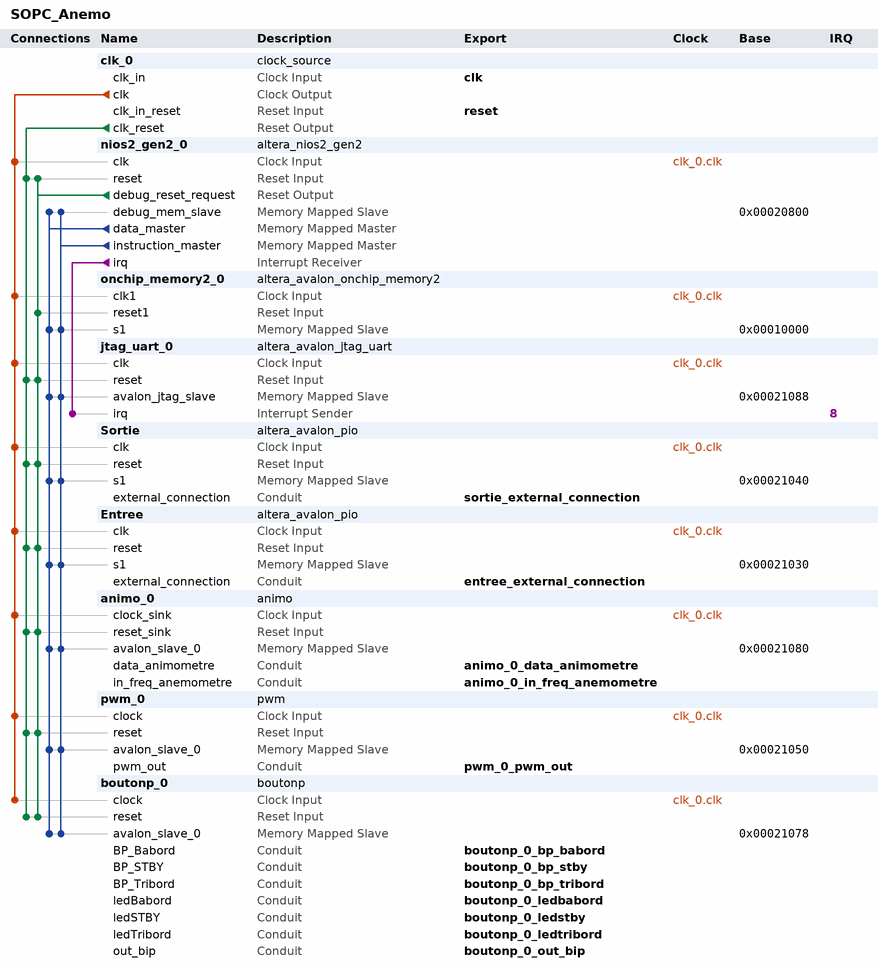
[diagram p0: system contents]
# Platform Designer (Qsys) system SOPC_Anemo, Cyclone IV E EP4CE22F17C6
# Parameters at their usual value, and those the tool derives, are not listed.
package require -exact qsys 18.1
create_system SOPC_Anemo
set_project_property DEVICE_FAMILY {Cyclone IV E}
set_project_property DEVICE EP4CE22F17C6

add_instance clk_0 clock_source 18.1
set_instance_parameter_value clk_0 clockFrequency 50000000

add_instance nios2_gen2_0 altera_nios2_gen2 18.1
set_instance_parameter_value nios2_gen2_0 dcache_size 2048
set_instance_parameter_value nios2_gen2_0 exceptionSlave onchip_memory2_0.s1
set_instance_parameter_value nios2_gen2_0 icache_size 4096
set_instance_parameter_value nios2_gen2_0 impl Tiny
set_instance_parameter_value nios2_gen2_0 resetSlave onchip_memory2_0.s1

add_instance onchip_memory2_0 altera_avalon_onchip_memory2 18.1
set_instance_parameter_value onchip_memory2_0 dataWidth 32
set_instance_parameter_value onchip_memory2_0 dualPort false
set_instance_parameter_value onchip_memory2_0 initMemContent true
set_instance_parameter_value onchip_memory2_0 initializationFileName onchip_mem.hex
set_instance_parameter_value onchip_memory2_0 memorySize 40960

add_instance jtag_uart_0 altera_avalon_jtag_uart 18.1
set_instance_parameter_value jtag_uart_0 simInteractiveOptions NO_INTERACTIVE_WINDOWS

add_instance Sortie altera_avalon_pio 18.1
set_instance_parameter_value Sortie direction Output
set_instance_parameter_value Sortie width 8

add_instance Entree altera_avalon_pio 18.1
set_instance_parameter_value Entree direction Input
set_instance_parameter_value Entree width 8

add_instance animo_0 animo 2.0

add_instance pwm_0 pwm 1.0
set_instance_parameter_value pwm_0 duty_bus 16
set_instance_parameter_value pwm_0 freq_bus 16

add_instance boutonp_0 boutonp 1.0

# connections
add_connection clk_0.clk animo_0.clock_sink clock
add_connection clk_0.clk boutonp_0.clock clock
add_connection clk_0.clk Entree.clk clock
add_connection clk_0.clk jtag_uart_0.clk clock
add_connection clk_0.clk nios2_gen2_0.clk clock
add_connection clk_0.clk onchip_memory2_0.clk1 clock
add_connection clk_0.clk pwm_0.clock clock
add_connection clk_0.clk Sortie.clk clock
add_connection clk_0.clk_reset animo_0.reset_sink reset
add_connection clk_0.clk_reset boutonp_0.reset reset
add_connection clk_0.clk_reset Entree.reset reset
add_connection clk_0.clk_reset jtag_uart_0.reset reset
add_connection clk_0.clk_reset nios2_gen2_0.reset reset
add_connection clk_0.clk_reset pwm_0.reset reset
add_connection clk_0.clk_reset Sortie.reset reset
add_connection nios2_gen2_0.debug_reset_request animo_0.reset_sink reset
add_connection nios2_gen2_0.debug_reset_request boutonp_0.reset reset
add_connection nios2_gen2_0.debug_reset_request Entree.reset reset
add_connection nios2_gen2_0.debug_reset_request jtag_uart_0.reset reset
add_connection nios2_gen2_0.debug_reset_request nios2_gen2_0.reset reset
add_connection nios2_gen2_0.debug_reset_request onchip_memory2_0.reset1 reset
add_connection nios2_gen2_0.debug_reset_request pwm_0.reset reset
add_connection nios2_gen2_0.debug_reset_request Sortie.reset reset
add_connection nios2_gen2_0.data_master animo_0.avalon_slave_0 avalon
set_connection_parameter_value nios2_gen2_0.data_master/animo_0.avalon_slave_0 baseAddress 0x00021080
add_connection nios2_gen2_0.data_master boutonp_0.avalon_slave_0 avalon
set_connection_parameter_value nios2_gen2_0.data_master/boutonp_0.avalon_slave_0 baseAddress 0x00021078
add_connection nios2_gen2_0.data_master Entree.s1 avalon
set_connection_parameter_value nios2_gen2_0.data_master/Entree.s1 baseAddress 0x00021030
add_connection nios2_gen2_0.data_master jtag_uart_0.avalon_jtag_slave avalon
set_connection_parameter_value nios2_gen2_0.data_master/jtag_uart_0.avalon_jtag_slave baseAddress 0x00021088
add_connection nios2_gen2_0.data_master nios2_gen2_0.debug_mem_slave avalon
set_connection_parameter_value nios2_gen2_0.data_master/nios2_gen2_0.debug_mem_slave baseAddress 0x00020800
add_connection nios2_gen2_0.data_master onchip_memory2_0.s1 avalon
set_connection_parameter_value nios2_gen2_0.data_master/onchip_memory2_0.s1 baseAddress 0x00010000
add_connection nios2_gen2_0.data_master pwm_0.avalon_slave_0 avalon
set_connection_parameter_value nios2_gen2_0.data_master/pwm_0.avalon_slave_0 baseAddress 0x00021050
add_connection nios2_gen2_0.data_master Sortie.s1 avalon
set_connection_parameter_value nios2_gen2_0.data_master/Sortie.s1 baseAddress 0x00021040
add_connection nios2_gen2_0.instruction_master animo_0.avalon_slave_0 avalon
set_connection_parameter_value nios2_gen2_0.instruction_master/animo_0.avalon_slave_0 baseAddress 0x00021080
add_connection nios2_gen2_0.instruction_master boutonp_0.avalon_slave_0 avalon
set_connection_parameter_value nios2_gen2_0.instruction_master/boutonp_0.avalon_slave_0 baseAddress 0x00021078
add_connection nios2_gen2_0.instruction_master Entree.s1 avalon
set_connection_parameter_value nios2_gen2_0.instruction_master/Entree.s1 baseAddress 0x00021030
add_connection nios2_gen2_0.instruction_master jtag_uart_0.avalon_jtag_slave avalon
set_connection_parameter_value nios2_gen2_0.instruction_master/jtag_uart_0.avalon_jtag_slave baseAddress 0x00021088
add_connection nios2_gen2_0.instruction_master nios2_gen2_0.debug_mem_slave avalon
set_connection_parameter_value nios2_gen2_0.instruction_master/nios2_gen2_0.debug_mem_slave baseAddress 0x00020800
add_connection nios2_gen2_0.instruction_master onchip_memory2_0.s1 avalon
set_connection_parameter_value nios2_gen2_0.instruction_master/onchip_memory2_0.s1 baseAddress 0x00010000
add_connection nios2_gen2_0.instruction_master pwm_0.avalon_slave_0 avalon
set_connection_parameter_value nios2_gen2_0.instruction_master/pwm_0.avalon_slave_0 baseAddress 0x00021050
add_connection nios2_gen2_0.instruction_master Sortie.s1 avalon
set_connection_parameter_value nios2_gen2_0.instruction_master/Sortie.s1 baseAddress 0x00021040
add_connection nios2_gen2_0.irq jtag_uart_0.irq interrupt
set_connection_parameter_value nios2_gen2_0.irq/jtag_uart_0.irq irqNumber 8

# exported interfaces
add_interface animo_0_data_animometre conduit end
set_interface_property animo_0_data_animometre EXPORT_OF animo_0.data_animometre
add_interface animo_0_in_freq_anemometre conduit end
set_interface_property animo_0_in_freq_anemometre EXPORT_OF animo_0.in_freq_anemometre
add_interface boutonp_0_bp_babord conduit end
set_interface_property boutonp_0_bp_babord EXPORT_OF boutonp_0.BP_Babord
add_interface boutonp_0_bp_stby conduit end
set_interface_property boutonp_0_bp_stby EXPORT_OF boutonp_0.BP_STBY
add_interface boutonp_0_bp_tribord conduit end
set_interface_property boutonp_0_bp_tribord EXPORT_OF boutonp_0.BP_Tribord
add_interface boutonp_0_ledbabord conduit end
set_interface_property boutonp_0_ledbabord EXPORT_OF boutonp_0.ledBabord
add_interface boutonp_0_ledstby conduit end
set_interface_property boutonp_0_ledstby EXPORT_OF boutonp_0.ledSTBY
add_interface boutonp_0_ledtribord conduit end
set_interface_property boutonp_0_ledtribord EXPORT_OF boutonp_0.ledTribord
add_interface boutonp_0_out_bip conduit end
set_interface_property boutonp_0_out_bip EXPORT_OF boutonp_0.out_bip
add_interface clk clock sink
set_interface_property clk EXPORT_OF clk_0.clk_in
add_interface entree_external_connection conduit end
set_interface_property entree_external_connection EXPORT_OF Entree.external_connection
add_interface pwm_0_pwm_out conduit end
set_interface_property pwm_0_pwm_out EXPORT_OF pwm_0.pwm_out
add_interface reset reset sink
set_interface_property reset EXPORT_OF clk_0.clk_in_reset
add_interface sortie_external_connection conduit end
set_interface_property sortie_external_connection EXPORT_OF Sortie.external_connection

set_interconnect_requirement {$system} qsys_mm.clockCrossingAdapter HANDSHAKE
set_interconnect_requirement {$system} qsys_mm.enableEccProtection FALSE
set_interconnect_requirement {$system} qsys_mm.insertDefaultSlave FALSE
set_interconnect_requirement {$system} qsys_mm.maxAdditionalLatency 1

save_system SOPC_Anemo.qsys
